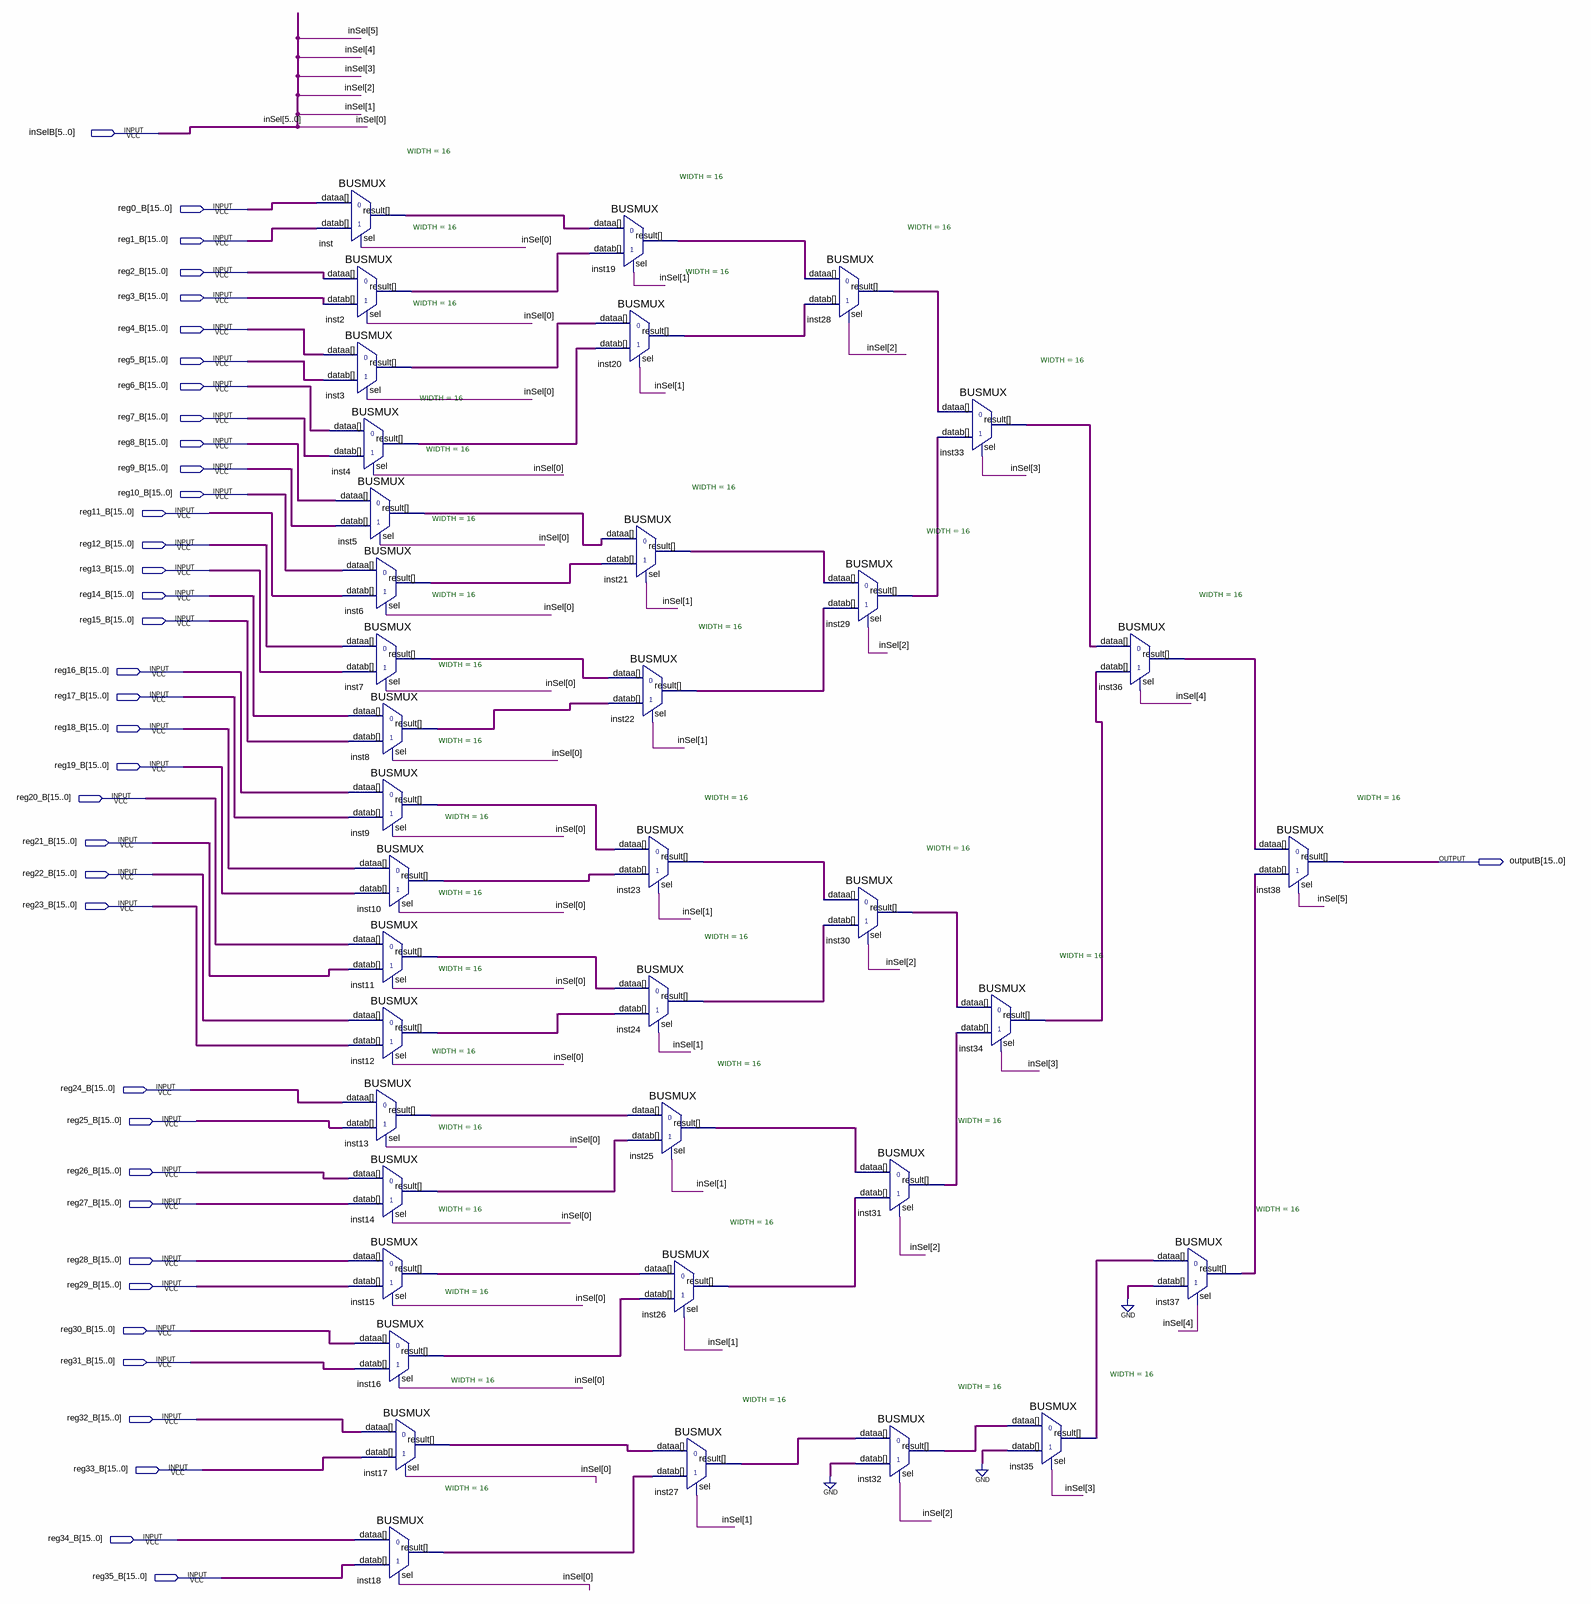
[diagram p0: schematic sheet]
// Quartus schematic ev20B3BUSB.bdf as structural Verilog: 38 symbols, 38 pins
module ev20B3BUSB (
  input  [5:0] inSelB,
  input  [15:0] reg0_B,
  input  [15:0] reg1_B,
  input  [15:0] reg2_B,
  input  [15:0] reg3_B,
  input  [15:0] reg4_B,
  input  [15:0] reg5_B,
  input  [15:0] reg6_B,
  input  [15:0] reg7_B,
  input  [15:0] reg8_B,
  input  [15:0] reg9_B,
  input  [15:0] reg10_B,
  input  [15:0] reg11_B,
  input  [15:0] reg12_B,
  input  [15:0] reg13_B,
  input  [15:0] reg14_B,
  input  [15:0] reg15_B,
  input  [15:0] reg16_B,
  input  [15:0] reg17_B,
  input  [15:0] reg18_B,
  input  [15:0] reg19_B,
  input  [15:0] reg20_B,
  input  [15:0] reg21_B,
  input  [15:0] reg22_B,
  input  [15:0] reg23_B,
  input  [15:0] reg24_B,
  input  [15:0] reg25_B,
  input  [15:0] reg26_B,
  input  [15:0] reg27_B,
  input  [15:0] reg28_B,
  input  [15:0] reg29_B,
  input  [15:0] reg30_B,
  input  [15:0] reg31_B,
  input  [15:0] reg32_B,
  input  [15:0] reg33_B,
  input  [15:0] reg34_B,
  input  [15:0] reg35_B,
  output [15:0] outputB
);

  wire [15:0] inst2_result, inst3_result, inst4_result, inst5_result, inst6_result, inst7_result,
       inst8_result, inst9_result, inst10_result, inst11_result, inst12_result, inst13_result, inst14_result,
       inst15_result, inst16_result, inst17_result, inst18_result, inst19_result, inst20_result,
       inst21_result, inst22_result, inst23_result, inst24_result, inst25_result, inst26_result,
       inst27_result, inst28_result, inst29_result, inst30_result, inst31_result, inst32_result,
       inst33_result, inst34_result, inst35_result, inst36_result, inst37_result, inst_result;

  BUSMUX #(.WIDTH(16)) inst (.datab(reg1_B), .sel(inSelB[0]), .dataa(reg0_B), .result(inst_result));
  BUSMUX #(.WIDTH(16)) inst2 (.datab(reg3_B), .sel(inSelB[0]), .dataa(reg2_B), .result(inst2_result));
  BUSMUX #(.WIDTH(16)) inst3 (.datab(reg5_B), .sel(inSelB[0]), .dataa(reg4_B), .result(inst3_result));
  BUSMUX #(.WIDTH(16)) inst4 (.datab(reg7_B), .sel(inSelB[0]), .dataa(reg6_B), .result(inst4_result));
  BUSMUX #(.WIDTH(16)) inst5 (.datab(reg9_B), .sel(inSelB[0]), .dataa(reg8_B), .result(inst5_result));
  BUSMUX #(.WIDTH(16)) inst6 (.datab(reg11_B), .sel(inSelB[0]), .dataa(reg10_B), .result(inst6_result));
  BUSMUX #(.WIDTH(16)) inst7 (.datab(reg13_B), .sel(inSelB[0]), .dataa(reg12_B), .result(inst7_result));
  BUSMUX #(.WIDTH(16)) inst8 (.datab(reg15_B), .sel(inSelB[0]), .dataa(reg14_B), .result(inst8_result));
  BUSMUX #(.WIDTH(16)) inst9 (.datab(reg17_B), .sel(inSelB[0]), .dataa(reg16_B), .result(inst9_result));
  BUSMUX #(.WIDTH(16)) inst10 (.datab(reg19_B), .sel(inSelB[0]), .dataa(reg18_B), .result(inst10_result));
  BUSMUX #(.WIDTH(16)) inst11 (.datab(reg21_B), .sel(inSelB[0]), .dataa(reg20_B), .result(inst11_result));
  BUSMUX #(.WIDTH(16)) inst12 (.datab(reg23_B), .sel(inSelB[0]), .dataa(reg22_B), .result(inst12_result));
  BUSMUX #(.WIDTH(16)) inst13 (.datab(reg25_B), .sel(inSelB[0]), .dataa(reg24_B), .result(inst13_result));
  BUSMUX #(.WIDTH(16)) inst14 (.datab(reg27_B), .sel(inSelB[0]), .dataa(reg26_B), .result(inst14_result));
  BUSMUX #(.WIDTH(16)) inst15 (.datab(reg29_B), .sel(inSelB[0]), .dataa(reg28_B), .result(inst15_result));
  BUSMUX #(.WIDTH(16)) inst16 (.datab(reg31_B), .sel(inSelB[0]), .dataa(reg30_B), .result(inst16_result));
  BUSMUX #(.WIDTH(16)) inst17 (.datab(reg33_B), .sel(inSelB[0]), .dataa(reg32_B), .result(inst17_result));
  BUSMUX #(.WIDTH(16)) inst18 (.datab(reg35_B), .sel(inSelB[0]), .dataa(reg34_B), .result(inst18_result));
  BUSMUX #(.WIDTH(16)) inst19 (.datab(inst2_result), .sel(inSelB[1]), .dataa(inst_result), .result(inst19_result));
  BUSMUX #(.WIDTH(16)) inst20 (.datab(inst4_result), .sel(inSelB[1]), .dataa(inst3_result), .result(inst20_result));
  BUSMUX #(.WIDTH(16)) inst21 (.datab(inst6_result), .sel(inSelB[1]), .dataa(inst5_result), .result(inst21_result));
  BUSMUX #(.WIDTH(16)) inst22 (.datab(inst8_result), .sel(inSelB[1]), .dataa(inst7_result), .result(inst22_result));
  BUSMUX #(.WIDTH(16)) inst23 (.datab(inst10_result), .sel(inSelB[1]), .dataa(inst9_result), .result(inst23_result));
  BUSMUX #(.WIDTH(16)) inst24 (.datab(inst12_result), .sel(inSelB[1]), .dataa(inst11_result), .result(inst24_result));
  BUSMUX #(.WIDTH(16)) inst25 (.datab(inst14_result), .sel(inSelB[1]), .dataa(inst13_result), .result(inst25_result));
  BUSMUX #(.WIDTH(16)) inst26 (.datab(inst16_result), .sel(inSelB[1]), .dataa(inst15_result), .result(inst26_result));
  BUSMUX #(.WIDTH(16)) inst27 (.datab(inst18_result), .sel(inSelB[1]), .dataa(inst17_result), .result(inst27_result));
  BUSMUX #(.WIDTH(16)) inst28 (.datab(inst20_result), .sel(inSelB[2]), .dataa(inst19_result), .result(inst28_result));
  BUSMUX #(.WIDTH(16)) inst29 (.datab(inst22_result), .sel(inSelB[2]), .dataa(inst21_result), .result(inst29_result));
  BUSMUX #(.WIDTH(16)) inst30 (.datab(inst24_result), .sel(inSelB[2]), .dataa(inst23_result), .result(inst30_result));
  BUSMUX #(.WIDTH(16)) inst31 (.datab(inst26_result), .sel(inSelB[2]), .dataa(inst25_result), .result(inst31_result));
  BUSMUX #(.WIDTH(16)) inst32 (.datab({16{1'b0}}), .sel(inSelB[2]), .dataa(inst27_result), .result(inst32_result));
  BUSMUX #(.WIDTH(16)) inst33 (.datab(inst29_result), .sel(inSelB[3]), .dataa(inst28_result), .result(inst33_result));
  BUSMUX #(.WIDTH(16)) inst34 (.datab(inst31_result), .sel(inSelB[3]), .dataa(inst30_result), .result(inst34_result));
  BUSMUX #(.WIDTH(16)) inst35 (.datab({16{1'b0}}), .sel(inSelB[3]), .dataa(inst32_result), .result(inst35_result));
  BUSMUX #(.WIDTH(16)) inst36 (.datab(inst34_result), .sel(inSelB[4]), .dataa(inst33_result), .result(inst36_result));
  BUSMUX #(.WIDTH(16)) inst37 (.datab({16{1'b0}}), .sel(inSelB[4]), .dataa(inst35_result), .result(inst37_result));
  BUSMUX #(.WIDTH(16)) inst38 (.datab(inst37_result), .sel(inSelB[5]), .dataa(inst36_result), .result(outputB));

  // Other names for the same wires on the sheet: inSel[5:0] = inSelB
endmodule
